# Altium schematic sheet FileTwo.SchDoc
size A4; SheetNumber: 4; SheetTotal: 8
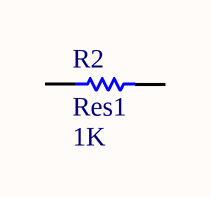
[diagram p0: FileTwo.SchDoc]

## Parts
R2  Res1  value 1K  [AXIAL-0.3]

## Nets

Not connected (* = marked no-connect by the designer): R2 1 2

## Library data of the parts
R2 = Res1: Resistor; Published: 8-Jun-2000; LatestRevisionDate: 17-Jul-2002; LatestRevisionNote: Re-released for DXP Platform.; PackageReference: AXIAL-0.3; Publisher: Altium Limited; PackageDescription: Axial Device, Thru-Hole; 2 Leads; 0.3 in Pin Spacing